# Altium schematic sheet mcu_stm32h563.SchDoc
size C; SheetNumber: 2
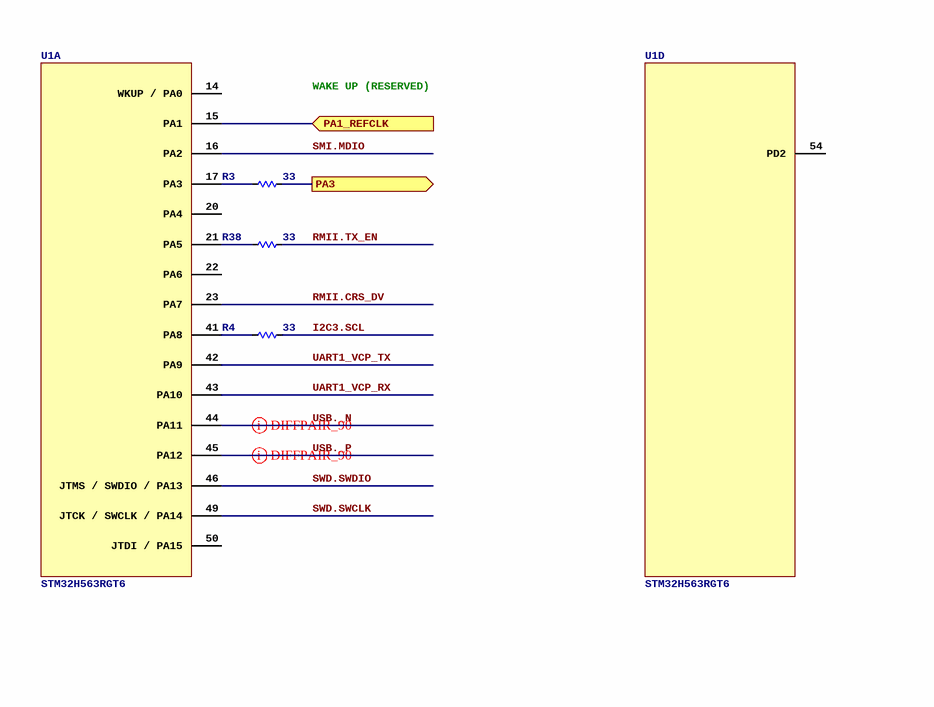
[diagram p0: mcu_stm32h563.SchDoc, top left]
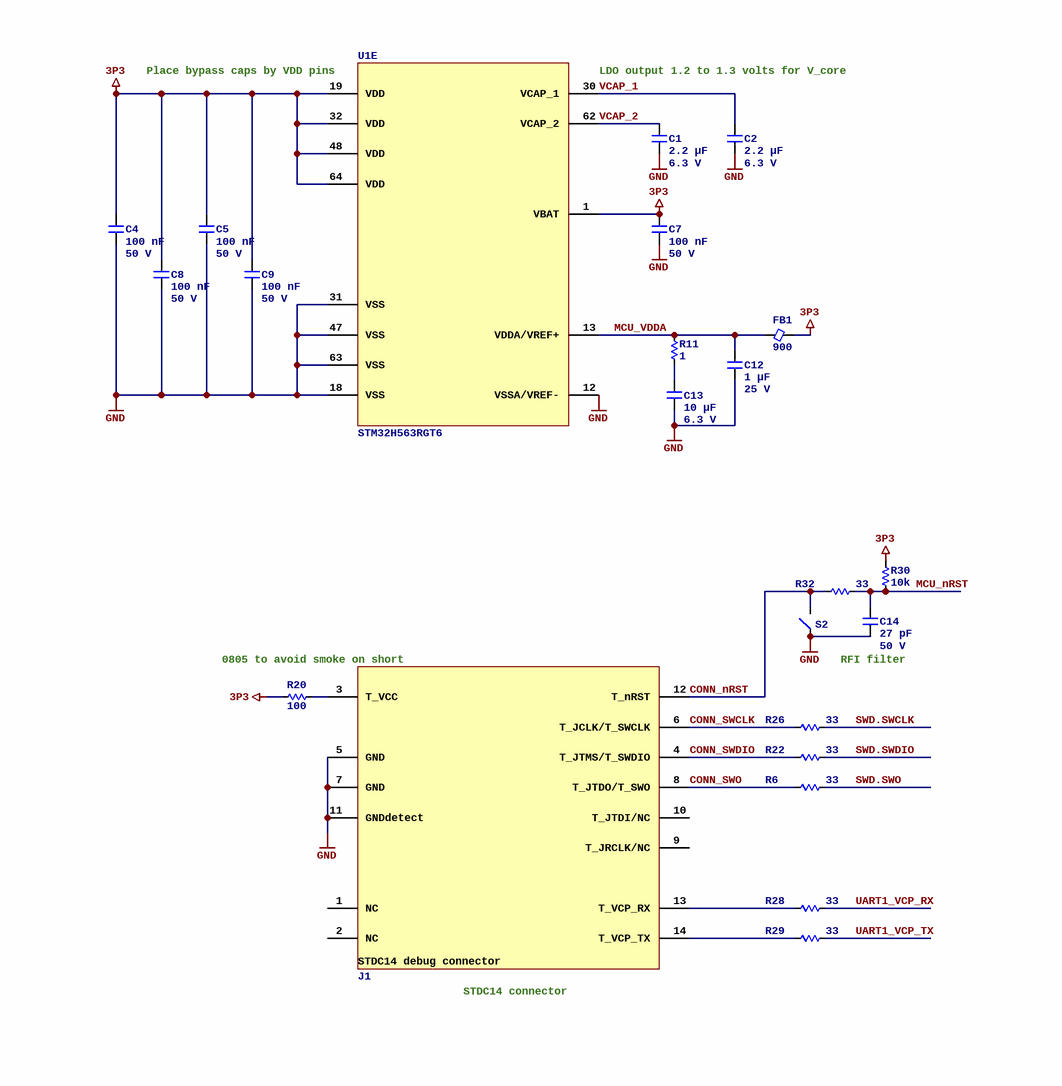
[diagram p1: mcu_stm32h563.SchDoc, top right]
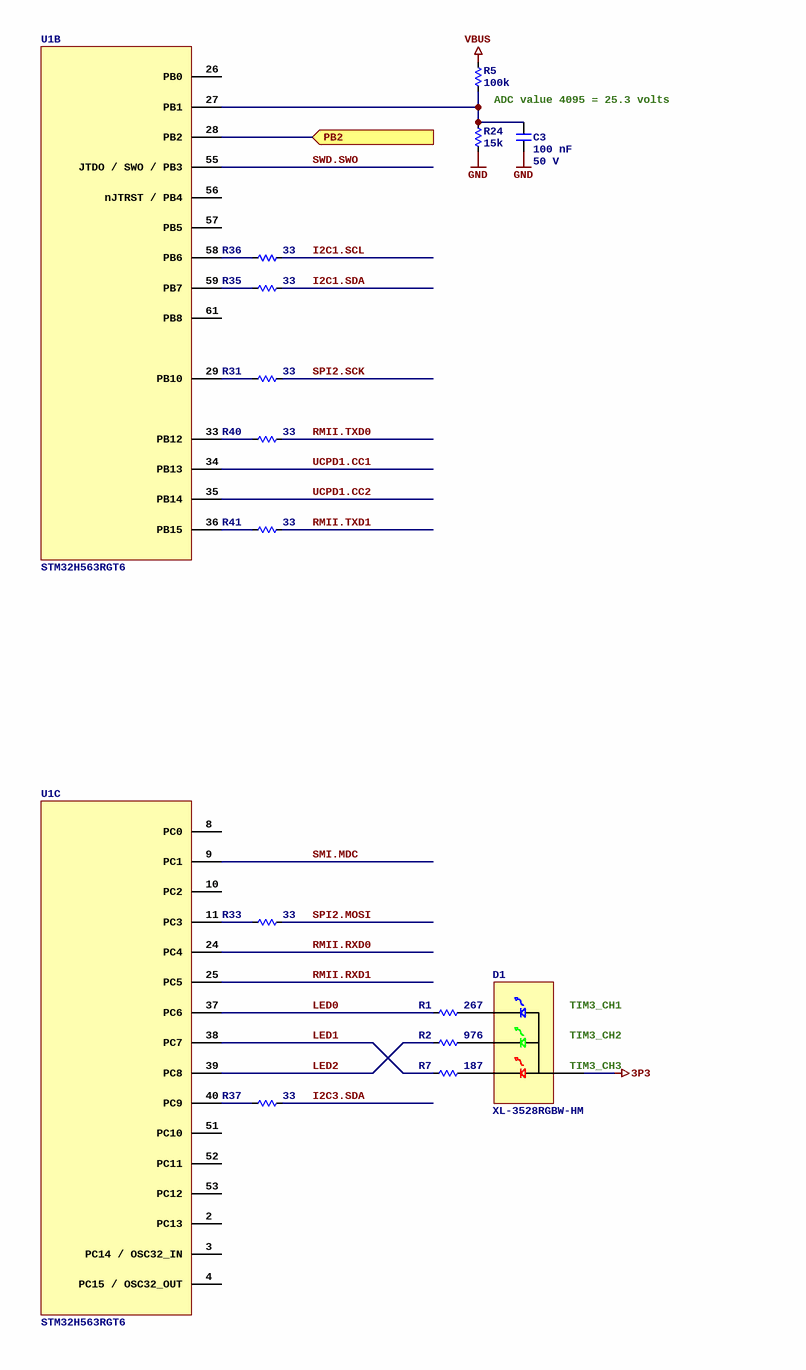
[diagram p2: mcu_stm32h563.SchDoc, bottom left]
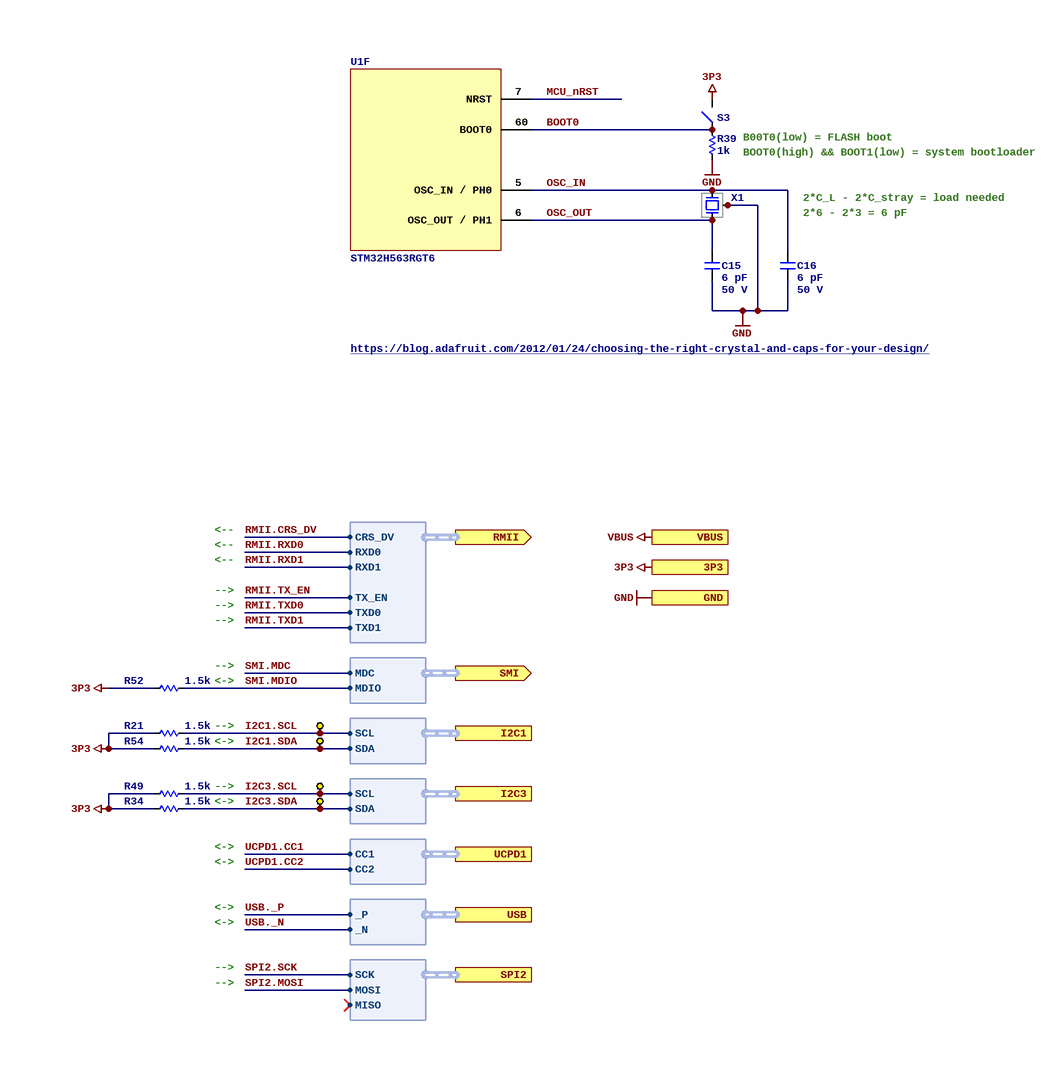
[diagram p3: mcu_stm32h563.SchDoc, bottom right]

## Parts
C1  Capacitance: 2.2 µF  Voltage Rating: 6.3 V  [C0603]  (hidden comment: GCM188R70J225KE22D)
C2  Capacitance: 2.2 µF  Voltage Rating: 6.3 V  [C0603]  (hidden comment: GCM188R70J225KE22D)
C3  Capacitance: 100 nF  Voltage Rating: 50 V  [C0402]  (hidden comment: CL05B104KB54PNC)
C4  Capacitance: 100 nF  Voltage Rating: 50 V  [C0402]  (hidden comment: CL05B104KB54PNC)
C5  Capacitance: 100 nF  Voltage Rating: 50 V  [C0402]  (hidden comment: CL05B104KB54PNC)
C7  Capacitance: 100 nF  Voltage Rating: 50 V  [C0402]  (hidden comment: CL05B104KB54PNC)
C8  Capacitance: 100 nF  Voltage Rating: 50 V  [C0402]  (hidden comment: CL05B104KB54PNC)
C9  Capacitance: 100 nF  Voltage Rating: 50 V  [C0402]  (hidden comment: CL05B104KB54PNC)
C12  Capacitance: 1 µF  Voltage Rating: 25 V  [C0603]  (hidden comment: CL10B105KA8NNNC)
C13  Capacitance: 10 µF  Voltage Rating: 6.3 V  [C0805]  (hidden comment: CC0805KKX7R5BB106)
C14  Capacitance: 27 pF  Voltage Rating: 50 V  [C0402]  (hidden comment: CC0402JRNPO9BN270)
C15  Capacitance: 6 pF  Voltage Rating: 50 V  [C0402]  (hidden comment: CC0402CRNPO9BN6R0)
C16  Capacitance: 6 pF  Voltage Rating: 50 V  [C0402]  (hidden comment: CC0402CRNPO9BN6R0)
D1  XL-3528RGBW-HM  [LED_RGB_SMD3528-4P]
FB1  Current Rating (mA): 900  [FB0402]  (hidden comment: BLM15PX601SN1D)
J1  FTSH-107-01-L-DV-K-A  [SAMTEC_FTSH-107-01-L-DV-K-A]  (value not drawn)
R1  value 267  [R0402]  (hidden comment: FRC0402F2670TS)
R2  value 976  [R0402]  (hidden comment: RTT029760FTH)
R3  value 33  [R0402]  (hidden comment: CRCW040233R0FKED)
R4  value 33  [R0402]  (hidden comment: CRCW040233R0FKED)
R5  value 100k  [R0402]  (hidden comment: 0402WGF1003TCE)
R6  value 33  [R0402]  (hidden comment: CRCW040233R0FKED)
R7  value 187  [R0402]  (hidden comment: ERJ2RKF1870X)
R11  value 1  [R0402]  (hidden comment: CRCW04021R00FKEDC)
R20  value 100  [R0805]  (hidden comment: AR05FTC1000)
R21  value 1.5k  [R0402]  (hidden comment: 0402WGF1501TCE)
R22  value 33  [R0402]  (hidden comment: CRCW040233R0FKED)
R24  value 15k  [R0402]  (hidden comment: 0402WGF1502TCE)
R26  value 33  [R0402]  (hidden comment: CRCW040233R0FKED)
R28  value 33  [R0402]  (hidden comment: CRCW040233R0FKED)
R29  value 33  [R0402]  (hidden comment: CRCW040233R0FKED)
R30  value 10k  [R0402]  (hidden comment: 0402WGF1002TCE)
R31  value 33  [R0402]  (hidden comment: CRCW040233R0FKED)
R32  value 33  [R0402]  (hidden comment: CRCW040233R0FKED)
R33  value 33  [R0402]  (hidden comment: CRCW040233R0FKED)
R34  value 1.5k  [R0402]  (hidden comment: 0402WGF1501TCE)
R35  value 33  [R0402]  (hidden comment: CRCW040233R0FKED)
R36  value 33  [R0402]  (hidden comment: CRCW040233R0FKED)
R37  value 33  [R0402]  (hidden comment: CRCW040233R0FKED)
R38  value 33  [R0402]  (hidden comment: CRCW040233R0FKED)
R39  value 1k  [R0402]  (hidden comment: 0402WGF1001TCE)
R40  value 33  [R0402]  (hidden comment: CRCW040233R0FKED)
R41  value 33  [R0402]  (hidden comment: CRCW040233R0FKED)
R49  value 1.5k  [R0402]  (hidden comment: 0402WGF1501TCE)
R52  value 1.5k  [R0402]  (hidden comment: 0402WGF1501TCE)
R54  value 1.5k  [R0402]  (hidden comment: 0402WGF1501TCE)
S2  TS-1092S-B3D2-G  [SWITCH_TS-1092S-B3D2-G]  (value not drawn)
S3  TS-1092S-B3D2-G  [SWITCH_TS-1092S-B3D2-G]  (value not drawn)
TP1  (no value)  [TP_GRABBY]  (no BOM)
TP2  (no value)  [TP_GRABBY]  (no BOM)
TP62  (no value)  [TP_GRABBY]  (no BOM)
TP63  (no value)  [TP_GRABBY]  (no BOM)
U1  STM32H563RGT6  [64TQFP10]  (parts A,B,C,D,E,F of 6)
X1  XRCGB16M000FXN00R0  [4_SMD_2.0X1.6MM]  (value not drawn)

## Ports
3P3, GND, I2C1 (harness I2C), I2C3 (harness I2C), PA1_REFCLK (in), PA3 (out), PB2 (in), RMII (out, harness RMII), SMI (out, harness SMI), SPI2 (harness SPI), UCPD1 (harness CC), USB (harness DIFF), VBUS

## Harnesses
RMII: CRS_DV, RXD0, RXD1, TX_EN, TXD0, TXD1
SMI: MDC, MDIO
DIFF: _P, _N
I2C: SCL, SDA
CC: CC2, CC1
SPI: MISO, MOSI, SCK

## Nets
3P3: C4.1 C5.1 C7.1 C8.1 C9.1 D1.2 FB1.2 R20.2 R21.2 R30.1 R34.2 R49.2 R52.2 R54.2 S3.2 U1.1(VBAT) U1.19(VDD) U1.32(VDD) U1.48(VDD) U1.64(VDD) ; port 3P3
GND: C1.2 C2.2 C3.2 C4.2 C5.2 C7.2 C8.2 C9.2 C12.2 C13.2 C14.2 C15.2 C16.2 J1.5(GND) J1.7(GND) J1.11(GNDdetect) R24.1 R39.2 S2.1 U1.12(VSSA/VREF-) U1.18(VSS) U1.31(VSS) U1.47(VSS) U1.63(VSS) X1.2 X1.4 ; port GND
VBUS: R5.2 ; port VBUS
BOOT0: R39.1 S3.1 U1.60(BOOT0)
CONN_nRST: J1.12(T_nRST) R32.2 S2.2
CONN_SWCLK: J1.6(T_JCLK/T_SWCLK) R26.2
CONN_SWDIO: J1.4(T_JTMS/T_SWDIO) R22.2
CONN_SWO: J1.8(T_JTDO/T_SWO) R6.2
I2C1.SCL: R21.1 R36.1 TP62.1 ; port I2C1.SCL
I2C1.SDA: R35.1 R54.1 TP63.1 ; port I2C1.SDA
I2C3.SCL: R4.1 R49.1 TP1.1 ; port I2C3.SCL
I2C3.SDA: R34.1 R37.1 TP2.1 ; port I2C3.SDA
LED0: R1.2 U1.37(PC6)
LED1: R7.2 U1.38(PC7)
LED2: R2.2 U1.39(PC8)
MCU_nRST: C14.1 R30.2 R32.1 U1.7(NRST)
MCU_VDDA: C12.1 FB1.1 R11.2 U1.13(VDDA/VREF+)
OSC_IN: C16.1 U1.5(OSC_IN_/_PH0) X1.3
OSC_OUT: C15.1 U1.6(OSC_OUT_/_PH1) X1.1
PA1_REFCLK: U1.15(PA1) ; port PA1_REFCLK
PA3: R3.1 ; port PA3
PB2: U1.28(PB2) ; port PB2
RMII.CRS_DV: U1.23(PA7) ; port RMII.CRS_DV
RMII.RXD0: U1.24(PC4) ; port RMII.RXD0
RMII.RXD1: U1.25(PC5) ; port RMII.RXD1
RMII.TX_EN: R38.1 ; port RMII.TX_EN
RMII.TXD0: R40.1 ; port RMII.TXD0
RMII.TXD1: R41.1 ; port RMII.TXD1
SMI.MDC: U1.9(PC1) ; port SMI.MDC
SMI.MDIO: R52.1 U1.16(PA2) ; port SMI.MDIO
SPI2.MOSI: R33.1 ; port SPI2.MOSI
SPI2.SCK: R31.1 ; port SPI2.SCK
SWD.SWCLK: R26.1 U1.49(JTCK_/_SWCLK_/_PA14)
SWD.SWDIO: R22.1 U1.46(JTMS_/_SWDIO_/_PA13)
SWD.SWO: R6.1 U1.55(JTDO_/_SWO_/_PB3)
UART1_VCP_RX: R28.1 U1.43(PA10)
UART1_VCP_TX: R29.1 U1.42(PA9)
UCPD1.CC1: U1.34(PB13) ; port UCPD1.CC1
UCPD1.CC2: U1.35(PB14) ; port UCPD1.CC2
USB._N: U1.44(PA11) ; port USB._N
USB._P: U1.45(PA12) ; port USB._P
VCAP_1: C2.1 U1.30(VCAP_1)
VCAP_2: C1.1 U1.62(VCAP_2)
NetC3_1: C3.1 R5.1 R24.2 U1.27(PB1)
NetC13_1: C13.1 R11.1
NetD1_1: D1.1 R7.1
NetD1_3: D1.3 R2.1
NetD1_4: D1.4 R1.1
NetJ1_3: J1.3(T_VCC) R20.1
NetJ1_13: J1.13(T_VCP_RX) R28.2
NetJ1_14: J1.14(T_VCP_TX) R29.2
NetR3_2: R3.2 U1.17(PA3)
NetR4_2: R4.2 U1.41(PA8)
NetR31_2: R31.2 U1.29(PB10)
NetR33_2: R33.2 U1.11(PC3)
NetR35_2: R35.2 U1.59(PB7)
NetR36_2: R36.2 U1.58(PB6)
NetR37_2: R37.2 U1.40(PC9)
NetR38_2: R38.2 U1.21(PA5)
NetR40_2: R40.2 U1.33(PB12)
NetR41_2: R41.2 U1.36(PB15)

Not connected (* = marked no-connect by the designer): J1 1(NC) 2(NC) 9(T_JRCLK/NC) 10(T_JTDI/NC); U1 2(PC13) 3(PC14_/_OSC32_IN) 4(PC15_/_OSC32_OUT) 8(PC0) 10(PC2) 14(WKUP_/_PA0) 20(PA4) 22(PA6) 26(PB0) 50(JTDI_/_PA15) 51(PC10) 52(PC11) 53(PC12) 54(PD2) 56(nJTRST_/_PB4) 57(PB5) 61(PB8)

## Layout directives
differential pair; differential pair class DE_90: USB._N, USB._P

## Notes on the sheet
- WAKE UP (RESERVED)
- (near U1) Place bypass caps by VDD pins
- (near U1) LDO output 1.2 to 1.3 volts for V_core
- 0805 to avoid smoke on short
- RFI filter
- ADC value 4095 = 25.3 volts
- (near J1) STDC14 connector
- B00T0(low) = FLASH boot
- BOOT0(high) && BOOT1(low) = system bootloader
- 2*C_L - 2*C_stray = load needed
- (near C16) 2*6 - 2*3 = 6 pF
- https://blog.adafruit.com/2012/01/24/choosing-the-right-crystal-and-caps-for-your-design/
- <--
- -->
- <->
- (near R52) -->
- (near D1) TIM3_CH1
- (near D1) TIM3_CH2
- (near D1) TIM3_CH3
- (in symbol FTSH-107-01-L-DV-K-A) STDC14 debug connector

## Library data of the parts
C1 C2 = GCM188R70J225KE22D: Manufacturer: Murata Electronics; Dielectric: X7R; ComponentLink1URL: https://wmsc.lcsc.com/wmsc/upload/file/pdf/v2/lcsc/1810311130_Murata-Electronics-GCM188R70J225KE22D_C126582.pdf; ComponentLink1Description: Datasheet; Manufacturer Part Number: GCM188R70J225KE22D; Package: 0603; Supplier 2: LCSC; Supplier Part Number 2: C126582
C3-C5 C7-C9 = CL05B104KB54PNC: Manufacturer: Samsung Electro-Mechanics; Dielectric: X7R; ComponentLink1URL: https://wmsc.lcsc.com/wmsc/upload/file/pdf/v2/lcsc/2304140030_Samsung-Electro-Mechanics-CL05B104KB54PNC_C307331.pdf; ComponentLink1Description: Datasheet; Manufacturer Part Number: CL05B104KB54PNC; Package: 0402; Supplier 2: LCSC; Supplier Part Number 2: C307331
C12 = CL10B105KA8NNNC: Manufacturer: Samsung Electro-Mechanics; Dielectric: X7R; ComponentLink1URL: https://wmsc.lcsc.com/wmsc/upload/file/pdf/v2/lcsc/2304140030_Samsung-Electro-Mechanics-CL10B105KA8NNNC_C29936.pdf; ComponentLink1Description: Datasheet; Manufacturer Part Number: CL10B105KA8NNNC; Package: 0603; Supplier 2: LCSC; Supplier Part Number 2: C29936
C13 = CC0805KKX7R5BB106: Manufacturer: YAGEO; Dielectric: X7R; ComponentLink1URL: https://wmsc.lcsc.com/wmsc/upload/file/pdf/v2/lcsc/2409272300_YAGEO-CC0805KKX7R5BB106_C527225.pdf; ComponentLink1Description: Datasheet; Manufacturer Part Number: CC0805KKX7R5BB106; Package: 0805; Supplier 2: LCSC; Supplier Part Number 2: C527225
C14 = CC0402JRNPO9BN270: Manufacturer: YAGEO; Dielectric: NP0; ComponentLink1URL: https://wmsc.lcsc.com/wmsc/upload/file/pdf/v2/lcsc/2304140030_YAGEO-CC0402JRNPO9BN270_C107002.pdf; ComponentLink1Description: Datasheet; Manufacturer Part Number: CC0402JRNPO9BN270; Package: 0402; Supplier 2: LCSC; Supplier Part Number 2: C107002
C15 C16 = CC0402CRNPO9BN6R0: Manufacturer: YAGEO; Dielectric: NP0; ComponentLink1URL: https://wmsc.lcsc.com/wmsc/upload/file/pdf/v2/lcsc/2007101237_YAGEO-CC0402CRNPO9BN6R0_C700515.pdf; ComponentLink1Description: Datasheet; Manufacturer Part Number: CC0402CRNPO9BN6R0; Package: 0402; Supplier 2: LCSC; Supplier Part Number 2: C700515
D1 = XL-3528RGBW-HM: LED Multi-Color Chip Red/Green/Blue 4-Pin PLCC T/R; Manufacturer: XINGLIGHT; LED Color: RGB; Supplier 1: DigiKey; Supplier Part Number 1: 5962-XL-3528RGBW-HMTR-ND; Manufacturer Part Number: XL-3528RGBW-HM; ComponentLink1Description: Datasheet; ComponentLink1URL: https://mm.digikey.com/Volume0/opasdata/d220001/medias/docus/8903/XL-3528RGBW-HM.pdf; Supplier 2: LCSC; Supplier Part Number 2: C2843813
FB1 = BLM15PX601SN1D: Manufacturer: Murata Electronics; Z @ 100 MHz: 600; DCR (mOhms): 230; ComponentLink1URL: https://wmsc.lcsc.com/wmsc/upload/file/pdf/v2/lcsc/2304140030_Murata-Electronics-BLM15PX601SN1D_C160977.pdf; ComponentLink1Description: Datasheet; Manufacturer Part Number: BLM15PX601SN1D; Supplier 2: LCSC; Supplier Part Number 2: C160977; Package: 0402
J1 = FTSH-107-01-L-DV-K-A: Connector Header Surface Mount 14 position 0.050" (1.27mm); Manufacturer: Samtec; Supplier 1: DigiKey; Supplier Part Number 1: FTSH-107-01-L-DV-K-A-ND; Manufacturer Part Number: FTSH-107-01-L-DV-K-A; Supplier 2: LCSC; Supplier Part Number 2: C5563894; Supplier 3: Mouser; Supplier Part Number 3: 200-FTSH10701LDVKA; ComponentLink1Description: Datasheet; ComponentLink1URL: https://mm.digikey.com/Volume0/opasdata/d220001/medias/docus/6209/ftsh-1xx-xx-xxx-dv-xxx-xxx-x-xx-mkt.pdf
R1 = FRC0402F2670TS: Manufacturer: FOJAN; Tolerance: 1%; Temperature Coefficient: ±100ppm/?; Power Rating (mW): 62.5; ComponentLink1Description: Datasheet; ComponentLink1URL: https://datasheet.lcsc.com/lcsc/2308241947_FOJAN-FRC0402F2670TS_C2998075.pdf; Manufacturer Part Number: FRC0402F2670TS; Package: 0402; Supplier 2: LCSC; Supplier Part Number 2: C2998075
R2 = RTT029760FTH: Manufacturer: RALEC; Tolerance: 1%; Temperature Coefficient: ±100ppm/?; Power Rating (mW): 62.5; ComponentLink1Description: Datasheet; ComponentLink1URL: https://wmsc.lcsc.com/wmsc/upload/file/pdf/v2/lcsc/2304140030_RALEC-RTT029760FTH_C11710.pdf; Manufacturer Part Number: RTT029760FTH; Package: 0402; Supplier 2: LCSC; Supplier Part Number 2: C11710
R3 R4 R6 R22 R26 R28 R29 R31-R33 R35-R38 R40 R41 = CRCW040233R0FKED: Manufacturer: Vishay Intertech; Tolerance: 1%; Temperature Coefficient: ±100ppm/?; Power Rating (mW): 63; ComponentLink1Description: Datasheet; ComponentLink1URL: https://wmsc.lcsc.com/wmsc/upload/file/pdf/v2/lcsc/2304140030_Vishay-Intertech-CRCW040233R0FKED_C242490.pdf; Manufacturer Part Number: CRCW040233R0FKED; Package: 0402; Supplier 2: LCSC; Supplier Part Number 2: C242490
R5 = 0402WGF1003TCE: Manufacturer: UNI-ROYAL(Uniroyal Elec); Power Rating (mW): 62.5; Tolerance: 1%; Temperature Coefficient: ±100ppm/?; Manufacturer Part Number: 0402WGF1003TCE; Package: 0402; Supplier 2: LCSC; Supplier Part Number 2: C25741; ComponentLink1Description: Datasheet; ComponentLink1URL: https://wmsc.lcsc.com/wmsc/upload/file/pdf/v2/lcsc/2206010100_UNI-ROYAL-Uniroyal-Elec-0402WGF1003TCE_C25741.pdf
R7 = ERJ2RKF1870X: Manufacturer: PANASONIC; Tolerance: 1%; Temperature Coefficient: ±100ppm/?; Power Rating (mW): 100; ComponentLink1Description: Datasheet; ComponentLink1URL: https://wmsc.lcsc.com/wmsc/upload/file/pdf/v2/lcsc/1912111437_PANASONIC-ERJ2RKF1870X_C416489.pdf; Manufacturer Part Number: ERJ2RKF1870X; Package: 0402; Supplier 2: LCSC; Supplier Part Number 2: C416489
R11 = CRCW04021R00FKEDC: Manufacturer: Vishay Intertech; Tolerance: 1%; Temperature Coefficient: ±100ppm/?; Power Rating (mW): 62.5; ComponentLink1Description: Datasheet; ComponentLink1URL: https://datasheet.lcsc.com/lcsc/2304140030_Vishay-Intertech-CRCW04021R00FKEDC_C2077765.pdf; Manufacturer Part Number: CRCW04021R00FKEDC; Package: 0402; Supplier 2: LCSC; Supplier Part Number 2: C2077765
R20 = AR05FTC1000: Manufacturer: Viking Tech; Tolerance: 1%; Temperature Coefficient: ±25ppm/?; ComponentLink1Description: Datasheet; ComponentLink1URL: https://wmsc.lcsc.com/wmsc/upload/file/pdf/v2/lcsc/2409280202_Viking-Tech-AR05FTC1000_C234699.pdf; Manufacturer Part Number: AR05FTC1000; Package: 0805; Power Rating (mW): 100; Supplier 2: LCSC; Supplier Part Number 2: C234699
R21 R34 R49 R52 R54 = 0402WGF1501TCE: Manufacturer: UNI-ROYAL(Uniroyal Elec); Tolerance: 1%; Temperature Coefficient: ±100ppm/?; Power Rating (mW): 62.5; ComponentLink1Description: Datasheet; ComponentLink1URL: https://wmsc.lcsc.com/wmsc/upload/file/pdf/v2/lcsc/2206010045_UNI-ROYAL-Uniroyal-Elec-0402WGF1501TCE_C25867.pdf; Manufacturer Part Number: 0402WGF1501TCE; Package: 0402; Supplier 2: LCSC; Supplier Part Number 2: C25867
R24 = 0402WGF1502TCE: Manufacturer: UNI-ROYAL(Uniroyal Elec); Power Rating (mW): 62.5; Tolerance: 1%; Temperature Coefficient: ±100ppm/?; Manufacturer Part Number: 0402WGF1502TCE; Package: 0402; Supplier 2: LCSC; Supplier Part Number 2: C25756; ComponentLink1Description: Datasheet; ComponentLink1URL: https://wmsc.lcsc.com/wmsc/upload/file/pdf/v2/lcsc/2206010100_UNI-ROYAL-Uniroyal-Elec-0402WGF1502TCE_C25756.pdf
R30 = 0402WGF1002TCE: Manufacturer: UNI-ROYAL(Uniroyal Elec); Tolerance: 1%; Temperature Coefficient: ±100ppm/?; Power Rating (mW): 62.5; ComponentLink1Description: Datasheet; ComponentLink1URL: https://wmsc.lcsc.com/wmsc/upload/file/pdf/v2/lcsc/2206010100_UNI-ROYAL-Uniroyal-Elec-0402WGF1002TCE_C25744.pdf; Manufacturer Part Number: 0402WGF1002TCE; Package: 0402; Supplier 2: LCSC; Supplier Part Number 2: C25744
R39 = 0402WGF1001TCE: Manufacturer: UNI-ROYAL(Uniroyal Elec); Tolerance: 1%; Temperature Coefficient: ±100ppm/?; Power Rating (mW): 62.5; ComponentLink1Description: Datasheet; ComponentLink1URL: https://wmsc.lcsc.com/wmsc/upload/file/pdf/v2/lcsc/2206010216_UNI-ROYAL-Uniroyal-Elec-0402WGF1001TCE_C11702.pdf; Manufacturer Part Number: 0402WGF1001TCE; Package: 0402; Supplier 2: LCSC; Supplier Part Number 2: C11702
S2 S3 = TS-1092S-B3D2-G: SWITCH TACTILE SPST-NO; Manufacturer: Yuandi; Manufacturer Part Number: TS-1092S-B3D2-G; ComponentLink1Description: Datasheet; ComponentLink1URL: https://www.lcsc.com/datasheet/lcsc_datasheet_2005071437_Yuandi-TS-1092S-B3D2-G_C520860.pdf; Supplier 2: LCSC; Supplier Part Number 2: C520860
TP1 TP2 TP62 TP63 = TEST_GRABBER: EMBEDDED TEST POINT FOR SALEAE TEST CLIPS; Manufacturer Part Number: TEST_GRABBER
U1 = STM32H563RGT6: ARM® Cortex®-M33 STM32H5 Microcontroller IC 32-Bit 250MHz 1MB (1M x 8) FLASH 64-LQFP (10x10); Manufacturer: ST Microelectronics; Manufacturer Part Number: STM32H563RGT6; Supplier 1: DigiKey; Supplier Part Number 1: 497-STM32H563RGT6-ND; Supplier 2: LCSC; Supplier Part Number 2: C22470894; ComponentLink1Description: Datasheet; ComponentLink1URL: https://www.st.com/resource/en/datasheet/stm32h562ag.pdf; ComponentLink2Description: Reference Manual; ComponentLink2URL: https://www.st.com/resource/en/reference_manual/rm0481-stm32h52333xx-stm32h56263xx-and-stm32h573xx-armbased-32bit-mcus-stmicroelectronics.pdf; Supplier 3: Mouser; Supplier Part Number 3: 511-STM32H563RGT6
X1 = XRCGB16M000FXN00R0: CRYSTAL 16.0000MHZ 6PF SMD; Manufacturer: Murata; Supplier 1: DigiKey; Supplier Part Number 1: 490-18282-1-ND; Manufacturer Part Number: XRCGB16M000FXN00R0; Supplier 2: LCSC; Supplier Part Number 2: C5222893; ComponentLink1Description: Datasheet; ComponentLink1URL: https://www.murata.com/products/productdata/8801076543518/SPEC-XRCGB25M000F3A00R0.pdf; Supplier 3: Mouser; Supplier Part Number 3: 81-XRCGB16M000FXN00R